# EAGLE schematic AtmegaRFM69 (EAGLE 6.5.0)
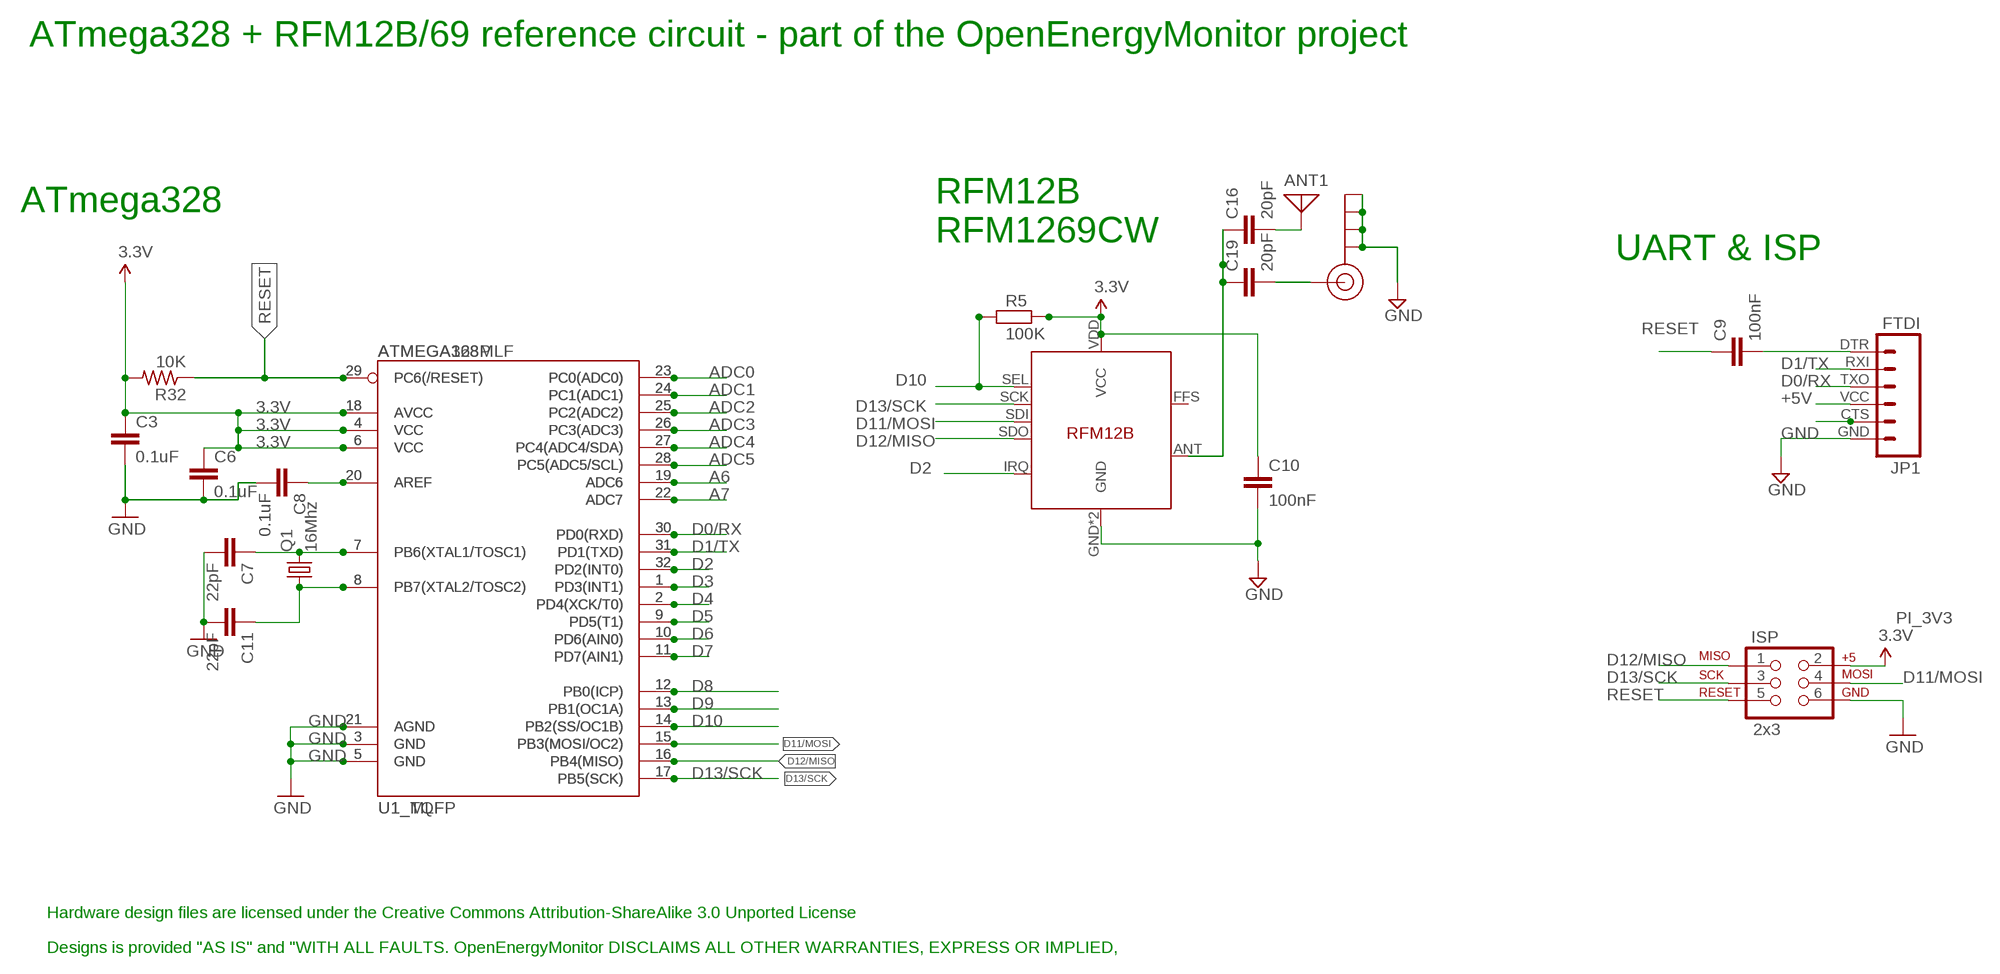
[diagram p0: schematic, sheet 1]

## Parts
ANT1  ANTENNA  [PAD-01]
C3  0.1uF  C-EUC0603  [C0603]
C6  0.1uF  C-EUC0603  [C0603]
C7  22pF  C-EUC0603  [C0603]
C8  0.1uF  C-EUC0603  [C0603]
C9  100nF  C-EUC0603  [C0603]
C10  100nF  C-EUC0603  [C0603]
C11  22pF  C-EUC0603  [C0603]
C16  20pF  C-EUC0603  [C0603]
C19  20pF  C-EUC0603  [C0603]
ISP  2x3  AVR_SPI_PRG_6PTH  [2X3]
J$1  SMA_EDGE  [SMA-EDGE]
JP1  FTDI  FTDI_BASICPTH  [FTDI_BASIC]
Q1  16Mhz  CRYSTALHC49UP  [HC49UP]
R5  100K  R-EU_R0603  [R0603]
R32  10K  R-US_R0603  [R0603]
U1_MLF  ATMEGA168MLF  [MLF32]
U1_TQFP  ATMEGA328P  ATMEGA328_SMT  [TQFP32-08]
U$14  RFM12B  [RFM12B]

## Nets
3.3V: C3.1 C6.1 C10.1 ISP.2 R5.2 R32.2 U1_MLF.4(VCC) U1_MLF.6(VCC) U1_MLF.18(AVCC) U1_TQFP.4(VCC) U1_TQFP.6(VCC) U1_TQFP.18(AVCC) U$14.VDD(VCC)
+5V [power]: JP1.VCC
A6: U1_MLF.19(ADC6) U1_TQFP.19(ADC6)
A7: U1_MLF.22(ADC7) U1_TQFP.22(ADC7)
ADC0: U1_MLF.23(PC0(ADC0)) U1_TQFP.23(PC0(ADC0))
ADC1: U1_MLF.24(PC1(ADC1)) U1_TQFP.24(PC1(ADC1))
ADC2: U1_MLF.25(PC2(ADC2)) U1_TQFP.25(PC2(ADC2))
ADC3: U1_MLF.26(PC3(ADC3)) U1_TQFP.26(PC3(ADC3))
ADC4: U1_MLF.27(PC4(ADC4/SDA)) U1_TQFP.27(PC4(ADC4/SDA))
ADC5: U1_MLF.28(PC5(ADC5/SCL)) U1_TQFP.28(PC5(ADC5/SCL))
D0/RX: JP1.TXO U1_MLF.30(PD0(RXD)) U1_TQFP.30(PD0(RXD))
D1/TX: JP1.RXI U1_MLF.31(PD1(TXD)) U1_TQFP.31(PD1(TXD))
D2: U1_MLF.32(PD2(INT0)) U1_TQFP.32(PD2(INT0)) U$14.IRQ
D3: U1_MLF.1(PD3(INT1)) U1_TQFP.1(PD3(INT1))
D4: U1_MLF.2(PD4(XCK/T0)) U1_TQFP.2(PD4(XCK/T0))
D5: U1_MLF.9(PD5(T1)) U1_TQFP.9(PD5(T1))
D6: U1_MLF.10(PD6(AIN0)) U1_TQFP.10(PD6(AIN0))
D7: U1_MLF.11(PD7(AIN1)) U1_TQFP.11(PD7(AIN1))
D8: U1_MLF.12(PB0(ICP)) U1_TQFP.12(PB0(ICP))
D9: U1_MLF.13(PB1(OC1A)) U1_TQFP.13(PB1(OC1A))
D10: R5.1 U1_MLF.14(PB2(SS/OC1B)) U1_TQFP.14(PB2(SS/OC1B)) U$14.SEL
D11/MOSI: ISP.4 U1_MLF.15(PB3(MOSI/OC2)) U1_TQFP.15(PB3(MOSI/OC2)) U$14.SDI
D12/MISO: ISP.1 U1_MLF.16(PB4(MISO)) U1_TQFP.16(PB4(MISO)) U$14.SDO
D13/SCK: ISP.3 U1_MLF.17(PB5(SCK)) U1_TQFP.17(PB5(SCK)) U$14.SCK
DIG1: C16.1 C19.1 U$14.ANT
GND [gnd]: C3.2 C6.2 C7.2 C8.2 C10.2 C11.2 ISP.6 J$1.GND@0(GND) J$1.GND@1(GND) J$1.GND@2(GND) J$1.GND@3(GND) JP1.GND U1_MLF.3(GND) U1_MLF.5(GND) U1_MLF.21(AGND) U1_TQFP.3(GND) U1_TQFP.5(GND) U1_TQFP.21(AGND) U$14.GND U$14.P$12(GND)
N$2: C7.1 Q1.2 U1_MLF.7(PB6(XTAL1/TOSC1)) U1_TQFP.7(PB6(XTAL1/TOSC1))
N$9: C11.1 Q1.1 U1_MLF.8(PB7(XTAL2/TOSC2)) U1_TQFP.8(PB7(XTAL2/TOSC2))
N$11: ANT1.1 C16.2
N$19: JP1.CTS
N$20: C8.1 U1_MLF.20(AREF) U1_TQFP.20(AREF)
N$23: C9.2 JP1.DTR
N$24: C19.2 J$1.SIG(SIGNAL)
RESET: C9.1 ISP.5 R32.1 U1_MLF.29(PC6(/RESET)) U1_TQFP.29(PC6(/RESET))
Unconnected: U$14.FFS

## Notes on the sheet
- ATmega328 + RFM12B/69 reference circuit - part of the OpenEnergyMonitor project
- ATmega328
- RFM12B
  RFM1269CW
- UART & ISP
- Hardware design files are licensed under the Creative Commons Attribution-ShareAlike 3.0 Unported License
- Designs is provided "AS IS" and "WITH ALL FAULTS. OpenEnergyMonitor DISCLAIMS ALL OTHER WARRANTIES, EXPRESS OR IMPLIED,

## Library data of the parts
ANT1 = discrete:ANTENNA: Antenna
C3 C9 C10 C16 C19 = rcl:C-EU: CAPACITOR, European symbol
C6-C8 C11 = resistor:C-EU: CAPACITOR, European symbol
ISP = SparkFun:AVR_SPI_PRG_6: AVR ISP 6 Pin This is the reduced ISP connector for AVR programming. Common on Arduino. This footprint will take up less PCB space and can be used with a 10-pin to 6-pin adapter such as SKU: BOB-08508
J$1 = SparkFun-Connectors:SMA_EDGE: SMA Antenna Connector End launch SMA connector. The paste layer has been removed so that the connector can be hand soldered onto the board after reflow.
JP1 = SparkFun:FTDI_BASIC: FTDI Basic: 3.3V and 5V
Q1 = adafruit:CRYSTAL: CRYSTAL; OC_FARNELL: unknown; OC_NEWARK: unknown
R5 = rcl:R-EU_: RESISTOR, European symbol
R32 = adafruit:R-US_: RESISTOR, American symbol
U1_MLF = SparkFun-DigitalIC:ATMEGA168: Atmel 32-pin 8-bit micro, 16k flash.
U1_TQFP = SparkFun-DigitalIC:ATMEGA328_SMT: 32-Pin Atmega328 part Commonly used on Arduino compatible boards Available in QFP and QFN packages TQFP is IC-09069 QFN is non-stock; PROD_ID: IC-09069
U$14 = JeeParts:RFM12B

## Net classes
0 default: width 0.203 mm, drill 0.6 mm, clearance 0.203 mm
1 power: width 0.305 mm, drill 0.6 mm, clearance 0.254 mm
2 gnd: width 0.254 mm, drill 0.6 mm, clearance 0.254 mm